# Altium schematic sheet LOGIC_LEVEL_SHIFTER.SchDoc
size A4; SheetNumber: 4; SheetTotal: 7
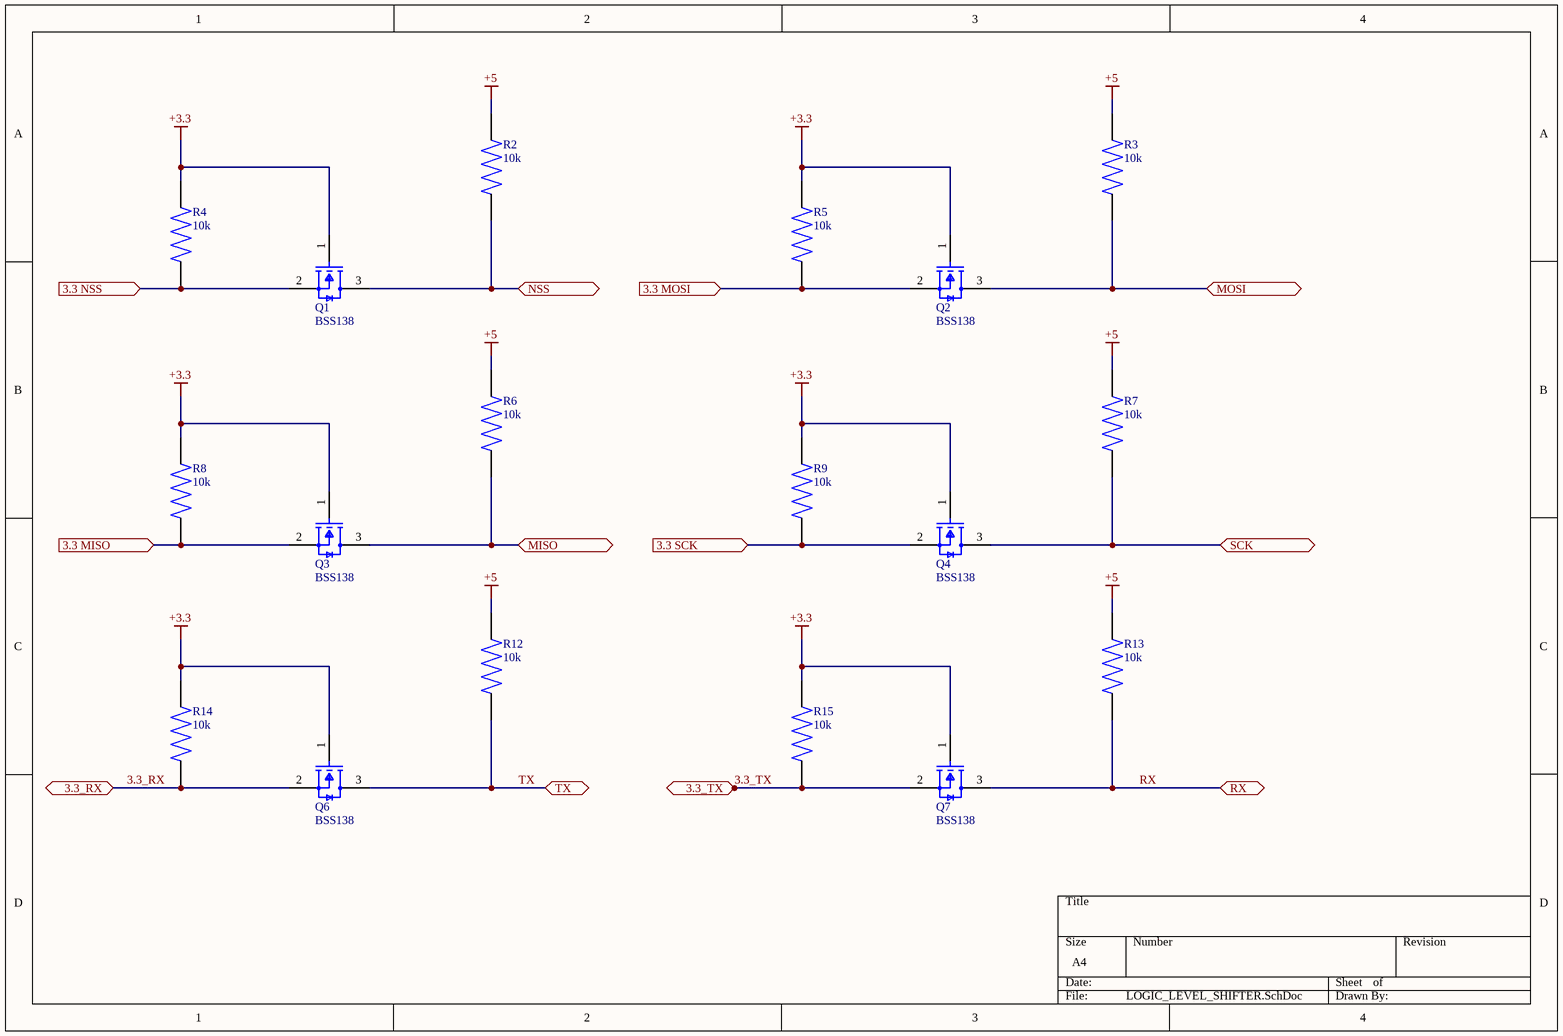
[diagram p0: LOGIC_LEVEL_SHIFTER.SchDoc]

## Parts
Q1  BSS138  [FP-318-08-IPC_B]
Q2  BSS138  [FP-318-08-IPC_B]
Q3  BSS138  [FP-318-08-IPC_B]
Q4  BSS138  [FP-318-08-IPC_B]
Q6  BSS138  [FP-318-08-IPC_B]
Q7  BSS138  [FP-318-08-IPC_B]
R2  10k  [RESC3115X65N]
R3  10k  [RESC3115X65N]
R4  10k  [RESC3115X65N]
R5  10k  [RESC3115X65N]
R6  10k  [RESC3115X65N]
R7  10k  [RESC3115X65N]
R8  10k  [RESC3115X65N]
R9  10k  [RESC3115X65N]
R12  10k  [RESC3115X65N]
R13  10k  [RESC3115X65N]
R14  10k  [RESC3115X65N]
R15  10k  [RESC3115X65N]

## Ports
3.3 MISO (in, see 1[3B], 2[1C]), 3.3 MOSI (in, see 1[3B], 2[1C]), 3.3 NSS (in, see 1[3C], 2[1C]), 3.3 SCK (in, see 1[3B], 2[1C]), 3.3_RX (bidir, see 1[3C], 3[3C]), 3.3_TX (bidir, see 1[3C], 3[3C]), MISO (bidir, see 1[3C], 5[3C]), MOSI (bidir, see 1[3C], 5[3C]), NSS (bidir, see 1[3C], 5[3C]), RX (bidir, see 1[3B], 5[3B]), SCK (bidir, see 1[3C], 5[3C]), TX (bidir, see 1[3B], 5[3B])

## Nets
+3.3: Q1.1(G) Q2.1(G) Q3.1(G) Q4.1(G) Q6.1(G) Q7.1(G) R4.2 R5.2 R8.2 R9.2 R14.2 R15.2
+5: R2.2 R3.2 R6.2 R7.2 R12.2 R13.2
3.3 MISO: Q3.2(S) R8.1 ; port 3.3 MISO
3.3 MOSI: Q2.2(S) R5.1 ; port 3.3 MOSI
3.3 NSS: Q1.2(S) R4.1 ; port 3.3 NSS
3.3 SCK: Q4.2(S) R9.1 ; port 3.3 SCK
3.3_RX: Q6.2(S) R14.1 ; port 3.3_RX
3.3_TX: Q7.2(S) R15.1 ; port 3.3_TX
MISO: Q3.3(D) R6.1 ; port MISO
MOSI: Q2.3(D) R3.1 ; port MOSI
NSS: Q1.3(D) R2.1 ; port NSS
RX: Q7.3(D) R13.1 ; port RX
SCK: Q4.3(D) R7.1 ; port SCK
TX: Q6.3(D) R12.1 ; port TX

## Library data of the parts
Q1-Q4 Q6 Q7 = CMP-07173-000101-1: MOSFET N-CH 50V 220MA SOT-23; Turn-Off Delay Time: 20ns; Element Configuration: Single; Rds On Max: 3.5R; Gate to Source Voltage (Vgs): 20V; Threshold Voltage: 1.3V; Number of Elements: 1; Power Dissipation: 360mW; Rise Time: 9ns; Turn-On Delay Time: 2.5ns; Input Capacitance: 27pF; On-State Resistance: 6R; Lead Free: Lead Free; Length: 2.92mm; Width: 1.3mm; Drain to Source Breakdown Voltage: 50V; Min Operating Temperature: -55°C; REACH SVHC: No SVHC; Packaging: Tape and Reel; Radiation Hardening: No; Height: 0.93mm; Drain to Source Voltage (Vdss): 50V; Current Rating: 220mA; Voltage Rating (DC): 50V; Weight: 0.03g; Continuous Drain Current (ID): 220mA; Number of Pins: 3; Nominal Vgs: 1.3V; Max Power Dissipation: 360mW; Fall Time: 9ns; Drain to Source Resistance: 3.5R; Contact Plating: Tin; Case/Package: SOT-23; Package Quantity: 1; Dual Supply Voltage: 50V; Mount: Surface Mount; Termination: SMD/SMT; Max Operating Temperature: 150°C
R2-R9 R12-R15 = CRG1206F4K7/10: Res Thick Film 1206 4.7K Ohm 1% 0.25W(1/4W) Â±100ppm/C Pad SMD T/R; Power_Rating: .25 W; MF: TE Connectivity; Voltage_Rating: 200 V; SnapEDA_Link: https://www.snapeda.com/parts/CRG1206F4K7/10/TE+Connectivity/view-part/?ref=snap; Package: 1206; Resistance: 4.7K; Value: *; MP: CRG1206F4K7/10; EU_RoHS_Compliance: Compliant with Exemptions; Tolerance: 1%; Check_prices: https://www.snapeda.com/parts/CRG1206F4K7/10/TE+Connectivity/view-part/?ref=eda